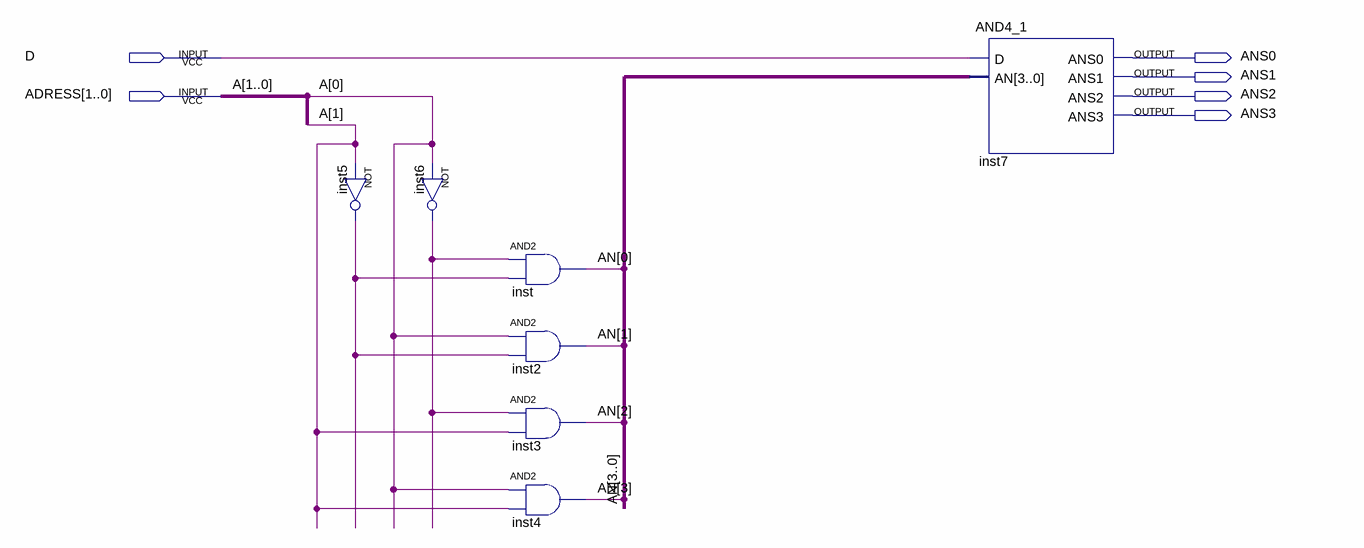
[diagram p0: schematic sheet]
// Quartus schematic Demux4.bdf as structural Verilog: 7 symbols, 6 pins
module Demux4 (
  input  D,
  input  [1:0] ADRESS,
  output ANS0,
  output ANS1,
  output ANS2,
  output ANS3
);

  wire inst5_out, inst6_out;
  wire [3:0] AN;

  not inst5 (inst5_out, ADRESS[1]);
  not inst6 (inst6_out, ADRESS[0]);
  and inst (AN[0], inst6_out, inst5_out);
  and inst2 (AN[1], ADRESS[0], inst5_out);
  and inst3 (AN[2], inst6_out, ADRESS[1]);
  and inst4 (AN[3], ADRESS[0], ADRESS[1]);
  AND4_1 inst7 (.D(D), .AN(AN), .ANS0(ANS0), .ANS1(ANS1), .ANS2(ANS2), .ANS3(ANS3));

  // Other names for the same wires on the sheet: A[1:0] = ADRESS
endmodule
